# Altium schematic sheet [01] COVER PAGE.SchDoc: KSDK
size A4; Author: Hom; CompanyName: KitSprout; DrawnBy: Hom; Engineer: Hom; Organization: KitSprout; Revision: A; SheetNumber: 1; SheetTotal: 2; Version: v2.0A; LibVersion: v3.3
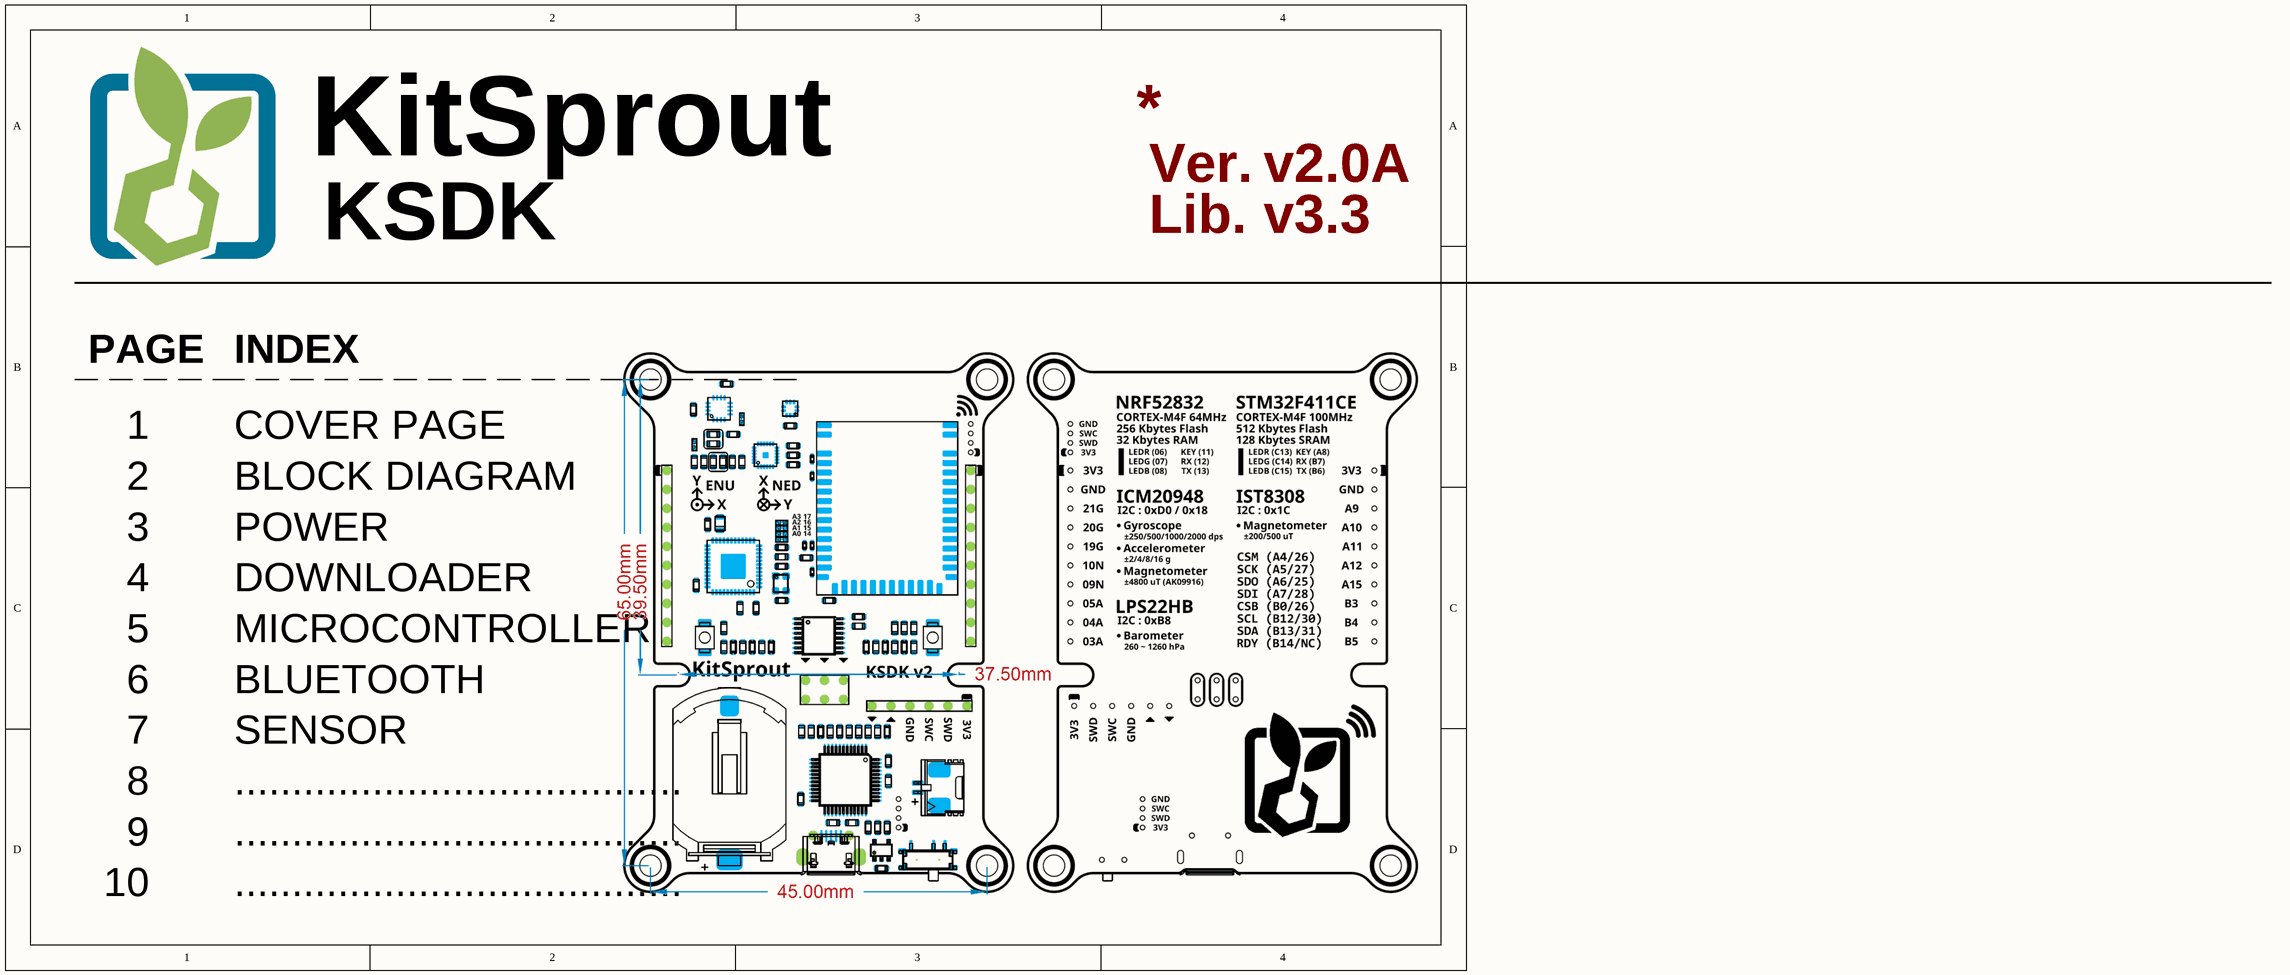
[diagram p0: [01] COVER PAGE.SchDoc]

## Notes on the sheet
- Ver.
- ________________________________________________________________________
- Lib.
- _ _ _ _ _
- PAGE
- _ _ _ _ _ _ _ _ _ _ _ _ _ _ _ _ _
- INDEX
- 1
- COVER PAGE
- 2
- 3
- BLOCK DIAGRAM
- POWER
- 4
- DOWNLOADER
- 5
- MICROCONTROLLER
- 6
- BLUETOOTH
- 7
- 8
- SENSOR
- .......................................
- 9
- 10